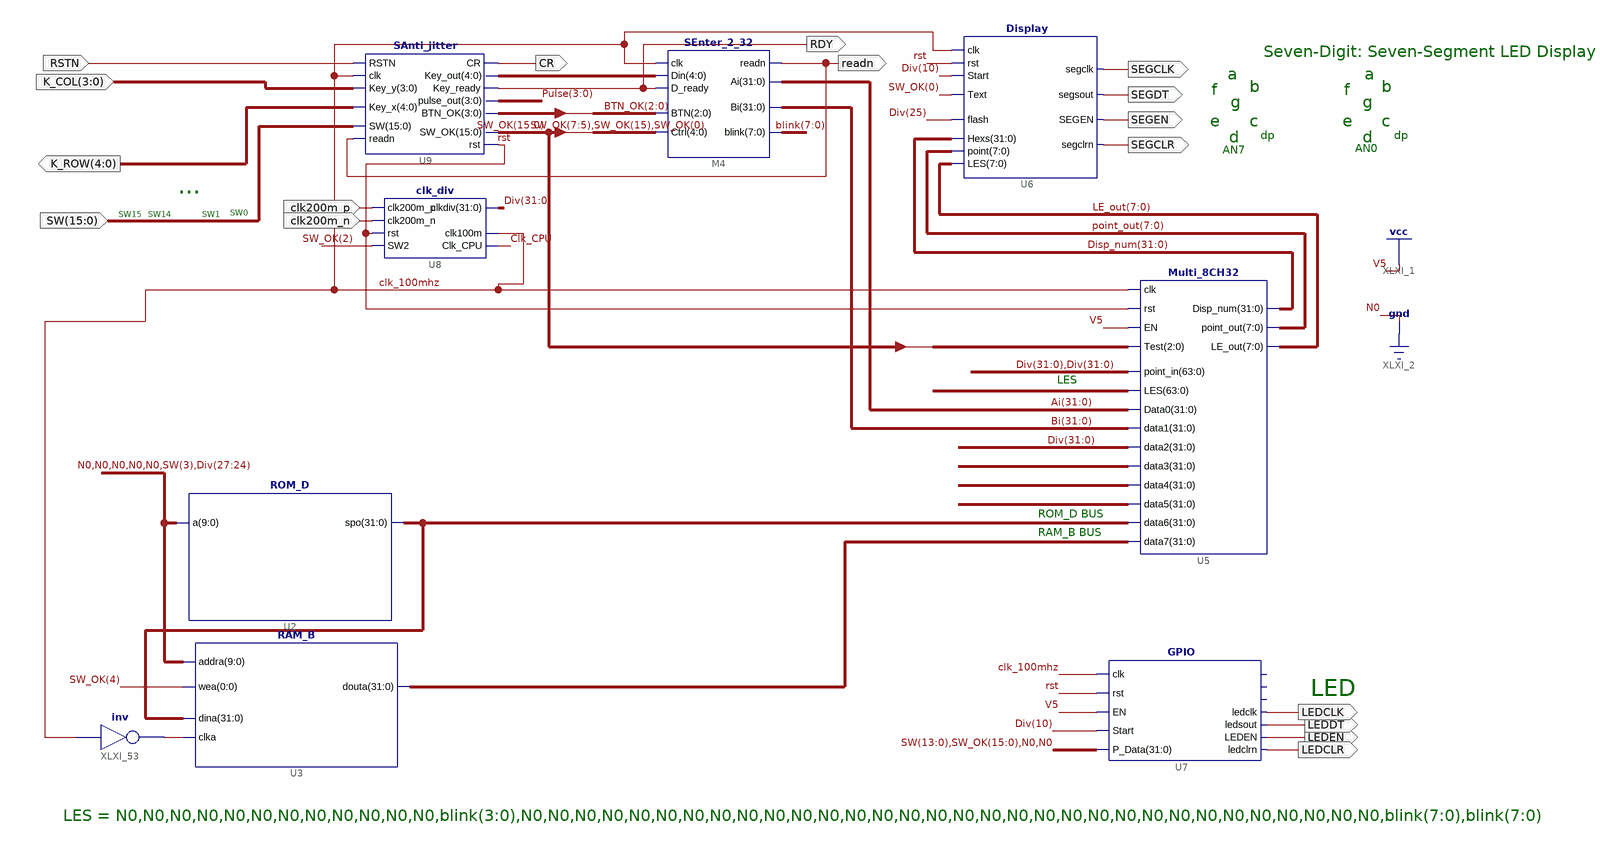
[diagram p0: schematic sheet 1]
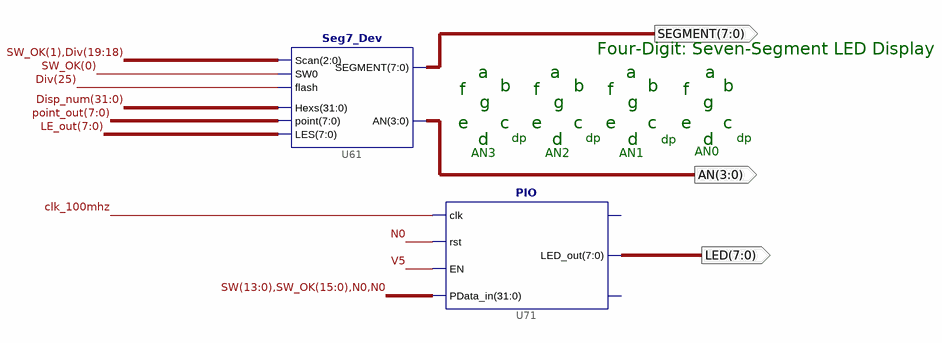
[diagram p1: schematic sheet 2]
// Xilinx ISE schematic OExp02.sch (kintex7) as structural Verilog: 11 symbols, 20 ports
module OExp02 (
  input  [15:0] SW,
  input  [3:0] K_COL,
  input  RSTN,
  input  clk200m_p,
  input  clk200m_n,
  output SEGCLK,
  output SEGDT,
  output SEGEN,
  output SEGCLR,
  output [7:0] SEGMENT,
  output [3:0] AN,
  output readn,
  output RDY,
  output [4:0] K_ROW,
  output CR,
  output [7:0] LED,
  output LEDCLK,
  output LEDDT,
  output LEDEN,
  output LEDCLR
);

  wire clk_100mhz, Clk_CPU, rst, XLXN_455;
  wire [3:0] BTN_OK, Pulse;
  wire [4:0] XLXN_444;
  wire [7:0] blink, LE_out, point_out;
  wire [15:0] SW_OK;
  wire [31:0] Ai, Bi, CNT, Disp_num, Div, XLXN_240, XLXN_280, XLXN_449, XLXN_469;

  Multi_8CH32 U5 (
    .Test(SW_OK[7:5]), .point_in({Div, Div}), .EN(1'b1), .clk(clk_100mhz), .rst(rst),
    .LES({{12{1'b0}}, blink[3:0], {32{1'b0}}, blink, blink}), .Data0(Ai), .data1(Bi), .data2(Div),
    .data3(CNT), .data4(XLXN_240), .data5(XLXN_280), .data6(XLXN_449), .data7(XLXN_469),
    .point_out(point_out), .LE_out(LE_out), .Disp_num(Disp_num));
  SAnti_jitter U9 (
    .SW(SW), .readn(readn), .Key_y(K_COL), .Key_x(K_ROW), .RSTN(RSTN), .clk(clk_100mhz), .Key_out(XLXN_444),
    .Key_ready(RDY), .CR(CR), .rst(rst), .SW_OK(SW_OK), .pulse_out(Pulse), .BTN_OK(BTN_OK));
  SEnter_2_32 M4 (
    .readn(readn), .Ai(Ai), .Bi(Bi), .blink(blink), .Din(XLXN_444), .D_ready(RDY), .clk(clk_100mhz),
    .Ctrl({SW_OK[7:5], SW_OK[15], SW_OK[0]}), .BTN(BTN_OK[2:0]));
  Seg7_Dev U61 (
    .LES(LE_out), .Scan({SW_OK[1], Div[19:18]}), .SEGMENT(SEGMENT), .AN(AN), .point(point_out),
    .flash(Div[25]), .SW0(SW_OK[0]), .Hexs(Disp_num));
  PIO U71 (
    .clk(clk_100mhz), .rst(1'b0), .EN(1'b1), .PData_in({SW[13:0], SW_OK, 2'b00}), .LED_out(LED));  // open: GPIOf0, counter_set
  ROM_D U2 (.a({{5{1'b0}}, SW[3], Div[27:24]}), .spo(XLXN_449));
  RAM_B U3 (.addra({{5{1'b0}}, SW[3], Div[27:24]}), .clka(XLXN_455), .wea(SW_OK[4]), .dina(XLXN_449), .douta(XLXN_469));
  not XLXI_53 (XLXN_455, clk_100mhz);
  GPIO #(.VeriModel("GPIO")) U7 (
    .clk(clk_100mhz), .P_Data({SW[13:0], SW_OK, 2'b00}), .rst(rst), .EN(1'b1), .Start(Div[10]),
    .ledclk(LEDCLK), .ledclrn(LEDCLR), .LEDEN(LEDEN), .ledsout(LEDDT));  // open: GPIOf0, LED_out, counter_set
  Display U6 (
    .LES(LE_out), .SEGEN(SEGEN), .segsout(SEGDT), .segclrn(SEGCLR), .point(point_out), .Hexs(Disp_num),
    .Text(SW_OK[0]), .flash(Div[25]), .segclk(SEGCLK), .clk(clk_100mhz), .rst(rst), .Start(Div[10]));
  clk_div U8 (
    .SW2(SW_OK[2]), .rst(rst), .clk200m_n(clk200m_n), .clk200m_p(clk200m_p), .Clk_CPU(Clk_CPU),
    .clk100m(clk_100mhz), .clkdiv(Div));

  // Notes on the sheet:
  //   Seven-Digit: Seven-Segment LED Display
  //   a
  //   a
  //   b
  //   b
  //   f
  //   f
  //   g
  //   g
  //   e
  //   c
  //   e
  //   c
  //   dp
  //   dp
  //   d
  //   d
  //   AN0
  //   AN7
  //   ...
  //   SW0
  //   SW15
  //   SW14
  //   SW1
  //   LES
  //   ROM_D BUS
  //   RAM_B BUS
  //   LED
  //   LES = N0,N0,N0,N0,N0,N0,N0,N0,N0,N0,N0,N0,blink(3:0),N0,N0,N0,N0,N0,N0,N0,N0,N0,N0,N0,N0,N0,N0,N0,N0,N0,N0,N0,N0,N0,N0,N0,N0,N0,N0,N0,N0,N0,N0,N0,N0,blink(7:0),blink(7:0)
  //   Four-Digit: Seven-Segment LED Display
  //   a
  //   a
  //   a
  //   a
  //   b
  //   b
  //   b
  //   b
  //   f
  //   f
  //   f
  //   f
  //   g
  //   g
  //   g
  //   g
  //   e
  //   c
  //   e
  //   c
  //   e
  //   c
  //   e
  //   c
  //   dp
  //   dp
  //   dp
  //   d
  //   d
  //   d
  //   dp
  //   d
  //   AN0
  //   AN3
  //   AN2
  //   AN1
  //   LOC on signal SW(15:0) = K13,K14,J13,J14,H13,H14,G12,F12
  //   LOC on signal K_COL(3:0) = E13,F14,G14,D14
endmodule
